# EAGLE design HIJACK_A (EAGLE 5.01)
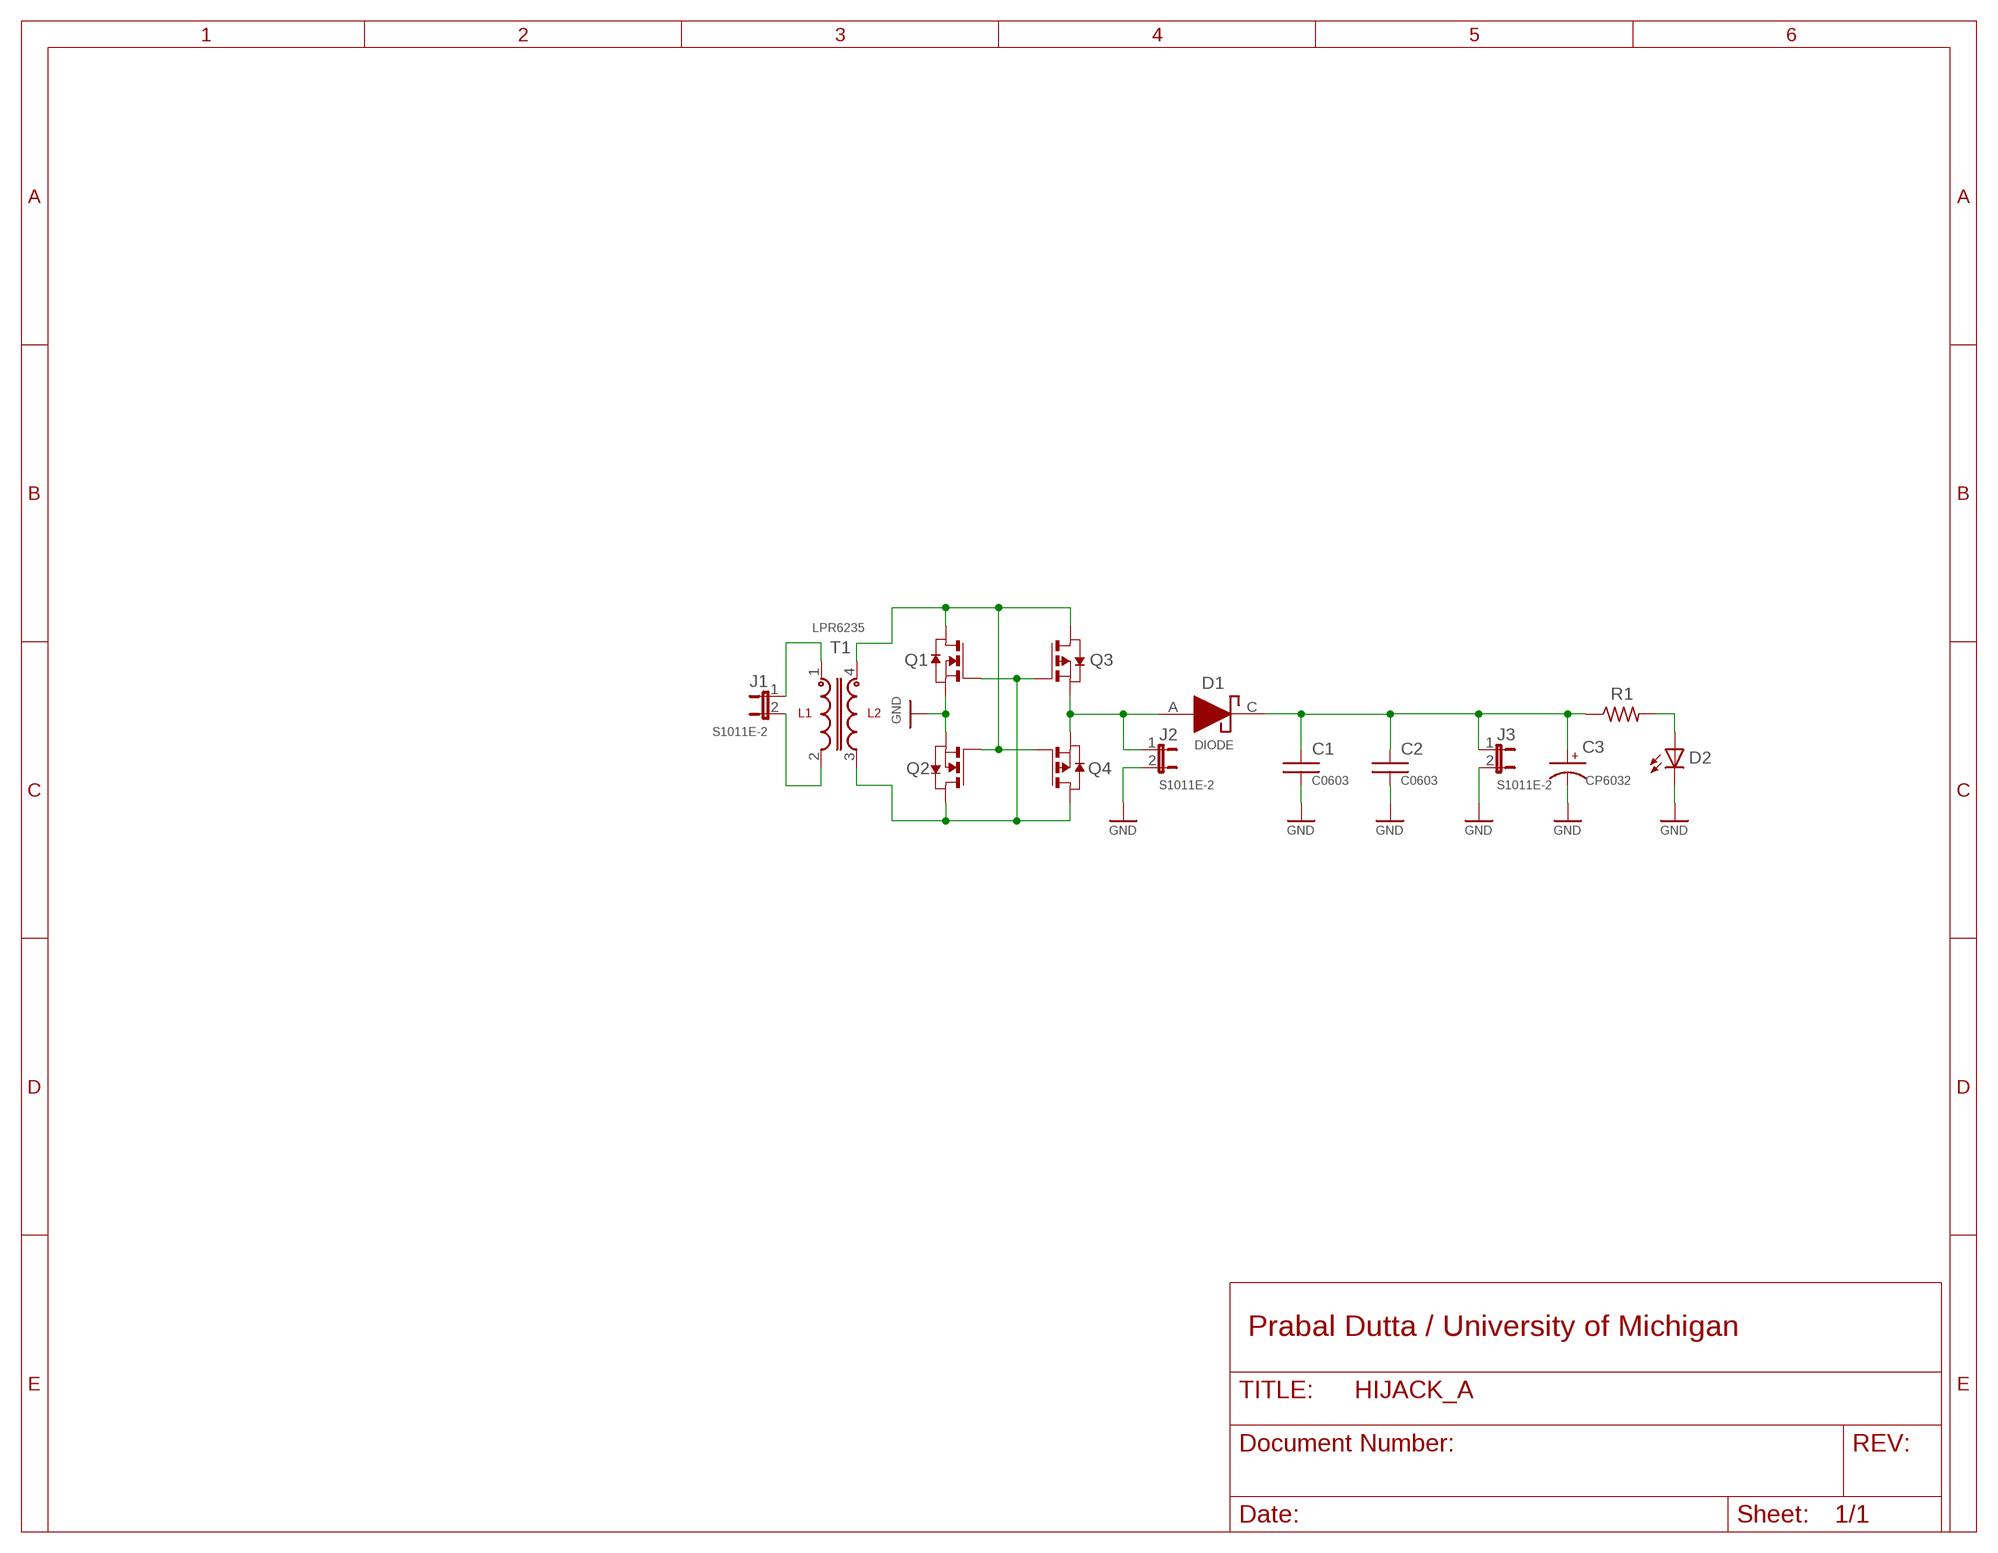
[diagram p0: schematic, sheet 1]

## Parts
C1  C0603  [C0603]
C2  C0603  [C0603]
C3  CP6032  [CT6032]
D1  DIODE  [MINIMELF]
D2  LED0603  [LED-0603]
J1  S1011E-2  JUMPER-2PTH  [1X02]
J2  S1011E-2  JUMPER-2PTH  [1X02]
J3  S1011E-2  JUMPER-2PTH  [1X02]
Q1  NMOSSOT23  [SOT-23]
Q2  NMOSSOT23  [SOT-23]
Q3  PMOSSOT23  [SOT-23]
Q4  PMOSSOT23  [SOT-23]
R1  R-US_R0603  [R0603]
T1  LPR6235  [LPR6235]

## Nets
GND: C1.2 C2.2 C3.- D2.C J2.2 J3.2 Q1.2(S) Q2.2(S)
N$1: J1.1 T1.1
N$2: Q1.3(G) Q2.1(D) Q3.3(G) Q4.1(D) T1.3
N$3: Q1.1(D) Q2.3(G) Q3.1(D) Q4.3(G) T1.4
N$4: C1.1 C2.1 C3.+ D1.C J3.1 R1.1
N$5: D2.A R1.2
N$16: J1.2 T1.2
N$17: D1.A J2.1 Q3.2(S) Q4.2(S)

## Notes on the sheet
- Prabal Dutta / University of Michigan

## Library data of the parts
C1 C2 = umich:C
C3 = umich:CP
D1 = umich:DIODE
D2 = umich:LED: LEDs Standard schematic elements and footprints for 5mm, 3mm, 1206, and 0603 sized LEDs. 5mm - Spark Fun Electronics SKU : COM-00529 (and others)
J1-J3 = umich:JUMPER-2: Jumper Basic 0.1" spaced jumper. Use with breakaway headers.
Q1 Q2 = zetex:NMOSSOT23: MOS FET
Q3 Q4 = zetex:PMOSSOT23: MOS FET
R1 = rcl:R-US_: RESISTOR, American symbol
T1 = umich:LPR6235

## Board
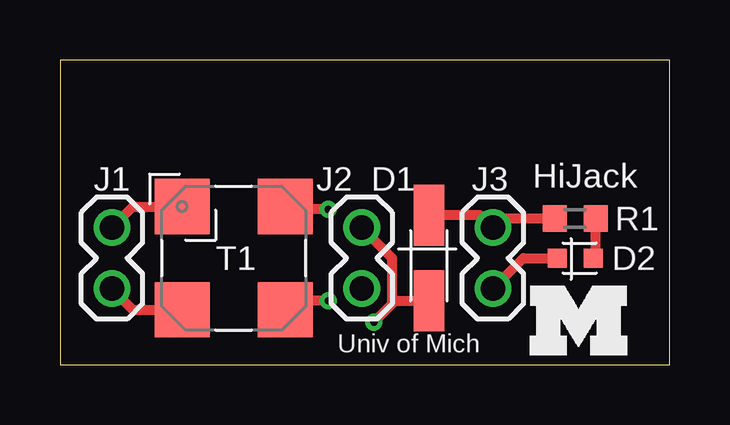
[diagram p1: board, top side]
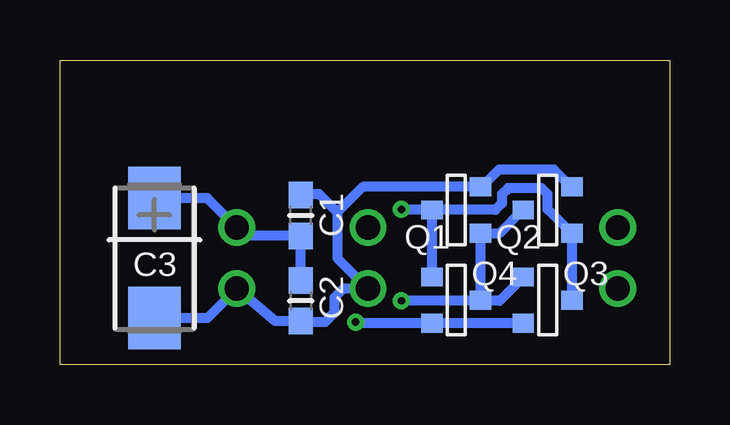
[diagram p2: board, bottom side, seen from below]

Size 25.4 x 12.7 mm. Coordinates in mm from the lower left corner, seen from the top.
Outline: 0,0 25.4,0 25.4,12.7 0,12.7 0,0
Copper layers (1*16): Top 0.035mm / dielectric 1.5mm / Bottom 0.035mm
Design rules "default *": minimum track width 8mil, minimum drill 12mil, track to track 8mil, track to pad 8mil, pad to pad 8mil, via to via 8mil, smd to smd 6mil, copper to edge 20mil, drill to drill 8mil, minimum pad ring 10mil, minimum via ring 8mil, stop-mask expansion 4mil, vias tented up to drill 0mil, thermal gap 10mil

### Footprints (pad centres in the part's own frame; a part is rotated, then mirrored left to right if it is on the bottom)
C0603 = smd 1.1 x 1: 1 -0.85,0; 2 0.85,0
CT6032 = smd 2.6 x 2.2: + -2.5,0; - 2.5,0
MINIMELF = smd 2.54 x 1.27: A -1.778,0; C 1.778,0
LED-0603 = smd 0.8 x 0.8: A 0,-0.75; C 0,0.75
1X02 = drill 1.016 round: 1 0,0; 2 2.54,0
SOT-23 = smd 0.787 x 0.889: 1 0.025,-1.016; 2 -0.94,1.016; 3 0.991,1.016
R0603 = smd 1 x 1.1: 1 -0.85,0; 2 0.85,0
LPR6235 = smd 2.3 x 2.3: 1 -2.15,2.15; 2 -2.15,-2.15; 3 2.15,-2.15; 4 2.15,2.15

### Placement (x,y rotation side)
C1  15.37,6.22 90 bottom
C2  15.37,2.67 270 bottom
C3  21.46,4.45 270 bottom
D1  15.37,4.45 90 top
D2  21.46,4.45 90 top
J1  2.16,5.71 270 top
J2  12.57,5.71 270 top
J3  18.03,5.71 270 top
Q1  8.89,6.48 270 bottom
Q2  5.08,6.48 270 bottom
Q3  5.08,2.67 90 bottom
Q4  8.89,2.67 90 bottom
R1  21.46,6.1 0 top
T1  7.24,4.45 0 top
U$2  [BLOCK-M]  19.56,0.38 0 top

### Tracks (layer width: path | path; a pad name or v marks a point on that pad's centre or on a via)
GND
  Top 0.406: D2.C 19.3,4.45 J3.2
  Bottom 0.406: Q2.2 4.06,7.37 4.83,8.13 7.11,8.13 7.82,7.42 Q1.2 12.78,7.42 13.84,6.35 | 13.84,6.35 13.84,4.45 J2.2 13.59,3.17 13.97,2.79 13.97,2.16 14.35,1.78 15.37,1.78 C2.2 16.42,1.82 J3.2 19.26,1.95 C3.- | 13.84,6.35 14.61,7.11 15.37,7.11 C1.2
N$1
  Top 0.406: T1.1 3.04,6.59 J1.1
N$2  (via drill 0.3)
  Top 0.406: T1.3 9.52,2.29 9.53,2.29 9.91,2.67 v11.18,2.67
  Bottom 0.406: 7.87,2.67 Q4.1 Q1.3 7.09,5.49 6.1,6.48 Q2.1 | Q3.3 7.09,2.67 7.87,2.67 | 7.87,2.67 v11.18,2.67
N$3  (via drill 0.3)
  Top 0.406: T1.4 9.52,6.59 9.53,6.6 9.65,6.48 v11.18,6.48
  Bottom 0.406: Q1.1 Q4.3 | Q1.1 7.26,6.45 6.99,6.73 6.99,7.11 6.73,7.37 5.33,7.37 5.08,7.11 5.08,6.48 4.06,5.46 Q2.3 Q3.1 4.06,2.67 | Q1.1 11.15,6.45 v11.18,6.48
N$4
  Top 0.406: D1.C 17.53,6.22 J3.1 18.16,5.71 18.54,6.1 R1.1
  Bottom 0.406: 15.37,3.43 C2.1 C1.1 17.69,5.37 J3.1 19.26,6.95 C3.+
N$5
  Top 0.406: D2.A 22.23,4.45 22.31,4.53 R1.2
N$16
  Top 0.406: T1.2 3.04,2.29 J1.2
N$17  (via drill 0.3)
  Top 0.406: v13.08,1.78 13.84,2.54 | 13.84,2.54 13.84,4.45 J2.1 | D1.A 13.97,2.67 13.84,2.54
  Bottom 0.406: 6.1,1.65 Q3.2 Q4.2 13.03,1.73 v13.08,1.78

### Text on the board
tPlace: HiJack | Univ of Mich